# Altium schematic sheet TOP.SchDoc: HB+SPO2 READER | TOP
size A4; DocumentNumber: 4; Revision: 1; SheetNumber: 1; SheetTotal: 4
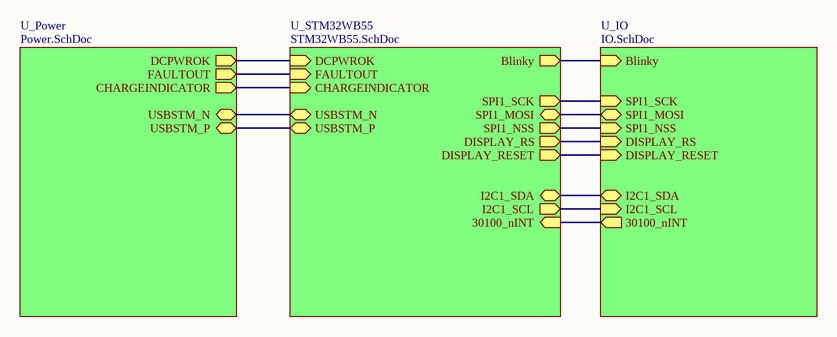
[diagram p0: TOP.SchDoc]

## Sub-sheets
U_IO = IO.SchDoc: Blinky (in), I2C1_SDA (bidir), I2C1_SCL (in), SPI1_MOSI (bidir), SPI1_SCK (in), SPI1_NSS (in), DISPLAY_RS (in), DISPLAY_RESET (in), 30100_nINT (out)
U_Power = Power.SchDoc: DCPWROK (out), FAULTOUT (out), CHARGEINDICATOR (out), USBSTM_P (bidir), USBSTM_N (bidir)
U_STM32WB55 = STM32WB55.SchDoc: USBSTM_N (bidir), USBSTM_P (bidir), DCPWROK (in), FAULTOUT (in), CHARGEINDICATOR (in), Blinky (out), I2C1_SDA (bidir), I2C1_SCL (out), SPI1_MOSI (bidir), SPI1_SCK (out), SPI1_NSS (out), DISPLAY_RS (out), DISPLAY_RESET (out), 30100_nINT (in)

## Nets
(unnamed): sheet U_IO/Blinky, sheet U_STM32WB55/Blinky
(unnamed): sheet U_IO/I2C1_SDA, sheet U_STM32WB55/I2C1_SDA
(unnamed): sheet U_IO/I2C1_SCL, sheet U_STM32WB55/I2C1_SCL
(unnamed): sheet U_IO/SPI1_MOSI, sheet U_STM32WB55/SPI1_MOSI
(unnamed): sheet U_IO/SPI1_SCK, sheet U_STM32WB55/SPI1_SCK
(unnamed): sheet U_IO/SPI1_NSS, sheet U_STM32WB55/SPI1_NSS
(unnamed): sheet U_IO/DISPLAY_RS, sheet U_STM32WB55/DISPLAY_RS
(unnamed): sheet U_IO/DISPLAY_RESET, sheet U_STM32WB55/DISPLAY_RESET
(unnamed): sheet U_IO/30100_nINT, sheet U_STM32WB55/30100_nINT
(unnamed): sheet U_Power/DCPWROK, sheet U_STM32WB55/DCPWROK
(unnamed): sheet U_Power/FAULTOUT, sheet U_STM32WB55/FAULTOUT
(unnamed): sheet U_Power/CHARGEINDICATOR, sheet U_STM32WB55/CHARGEINDICATOR
(unnamed): sheet U_Power/USBSTM_P, sheet U_STM32WB55/USBSTM_P
(unnamed): sheet U_Power/USBSTM_N, sheet U_STM32WB55/USBSTM_N

## Notes on the sheet
- Title
- Size:
- Date:
- A4
- Number:
- Time:
- Revision:
- Sheet
- of
- ShareFox
- ©
- File: